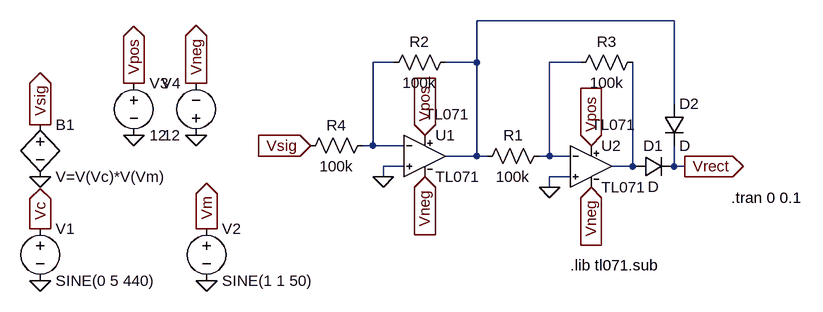
[diagram p0: schematic envfollow2.asc]
envfollow2.asc, the LTspice schematic file:
Version 4
SHEET 1 944 680
WIRE 736 160 432 160
WIRE 304 224 272 224
WIRE 432 224 432 160
WIRE 432 224 384 224
WIRE 592 224 544 224
WIRE 736 288 736 160
WIRE 272 352 272 224
WIRE 272 352 256 352
WIRE 320 352 272 352
WIRE 432 368 432 224
WIRE 432 368 384 368
WIRE 448 368 432 368
WIRE 544 368 544 224
WIRE 544 368 528 368
WIRE 576 368 544 368
WIRE 320 384 288 384
WIRE 672 384 672 224
WIRE 672 384 640 384
WIRE 736 384 736 352
WIRE 752 384 736 384
WIRE 288 400 288 384
WIRE 576 400 544 400
WIRE 544 416 544 400
FLAG -240 560 0
FLAG 16 560 0
FLAG -240 400 0
FLAG -240 480 Vc
IOPIN -240 480 Out
FLAG 16 480 Vm
IOPIN 16 480 Out
FLAG -240 320 Vsig
IOPIN -240 320 Out
FLAG -96 336 0
FLAG 0 336 0
FLAG -96 256 Vpos
IOPIN -96 256 Out
FLAG 0 256 Vneg
IOPIN 0 256 Out
FLAG 352 336 Vpos
IOPIN 352 336 In
FLAG 352 400 Vneg
IOPIN 352 400 In
FLAG 608 352 Vpos
IOPIN 608 352 In
FLAG 608 416 Vneg
IOPIN 608 416 In
FLAG 544 416 0
FLAG 176 352 Vsig
IOPIN 176 352 In
FLAG 752 384 Vrect
IOPIN 752 384 Out
FLAG 288 400 0
SYMBOL Voltage -240 464 R0
SYMATTR InstName V1
SYMATTR Value SINE(0 5 440)
SYMBOL Voltage 16 464 R0
SYMATTR InstName V2
SYMATTR Value SINE(1 1 50)
SYMBOL bv -240 304 R0
SYMATTR InstName B1
SYMATTR Value V=V(Vc)*V(Vm)
SYMBOL TL071 352 304 R0
SYMATTR InstName U1
SYMBOL Voltage -96 240 R0
SYMATTR InstName V3
SYMATTR Value 12
SYMBOL Voltage 0 352 R180
WINDOW 0 24 96 Left 2
WINDOW 3 24 16 Left 2
SYMATTR InstName V4
SYMATTR Value 12
SYMBOL TL071 608 320 R0
SYMATTR InstName U2
SYMBOL Diode 672 400 R270
WINDOW 0 32 32 VTop 2
WINDOW 3 0 32 VBottom 2
SYMATTR InstName D1
SYMBOL Diode 720 288 R0
SYMATTR InstName D2
SYMBOL Res 544 352 R90
WINDOW 0 0 56 VBottom 2
WINDOW 3 32 56 VTop 2
SYMATTR InstName R1
SYMATTR Value 100k
SYMBOL Res 400 208 R90
WINDOW 0 0 56 VBottom 2
WINDOW 3 32 56 VTop 2
SYMATTR InstName R2
SYMATTR Value 100k
SYMBOL Res 688 208 R90
WINDOW 0 0 56 VBottom 2
WINDOW 3 32 56 VTop 2
SYMATTR InstName R3
SYMATTR Value 100k
SYMBOL Res 272 336 R90
WINDOW 0 0 56 VBottom 2
WINDOW 3 32 56 VTop 2
SYMATTR InstName R4
SYMATTR Value 100k
TEXT 824 432 Left 2 !.tran 0 0.1
TEXT 576 536 Left 2 !.lib tl071.sub

The netlist it stands for:
* envfollow2.asc
V1 Vc 0 SINE(0 5 440)
V2 Vm 0 SINE(1 1 50)
B1 Vsig 0 V=V(Vc)*V(Vm)
XU1 0 N002 Vpos Vneg N001 TL071 TL071  ; pins In+ In- V+ V- OUT
V3 Vpos 0 12
V4 0 Vneg 12
XU2 0 N003 Vpos Vneg N004 TL071 TL071  ; pins In+ In- V+ V- OUT
D1 N004 Vrect D
D2 N001 Vrect D
R1 N003 N001 100k
R2 N001 N002 100k
R3 N004 N003 100k
R4 N002 Vsig 100k
.model D D
.lib standard.dio
.tran 0 0.1
.lib tl071.sub
.lib TL071.sub
.backanno
.end